# EAGLE design Samid6322 (EAGLE 9.6.2)
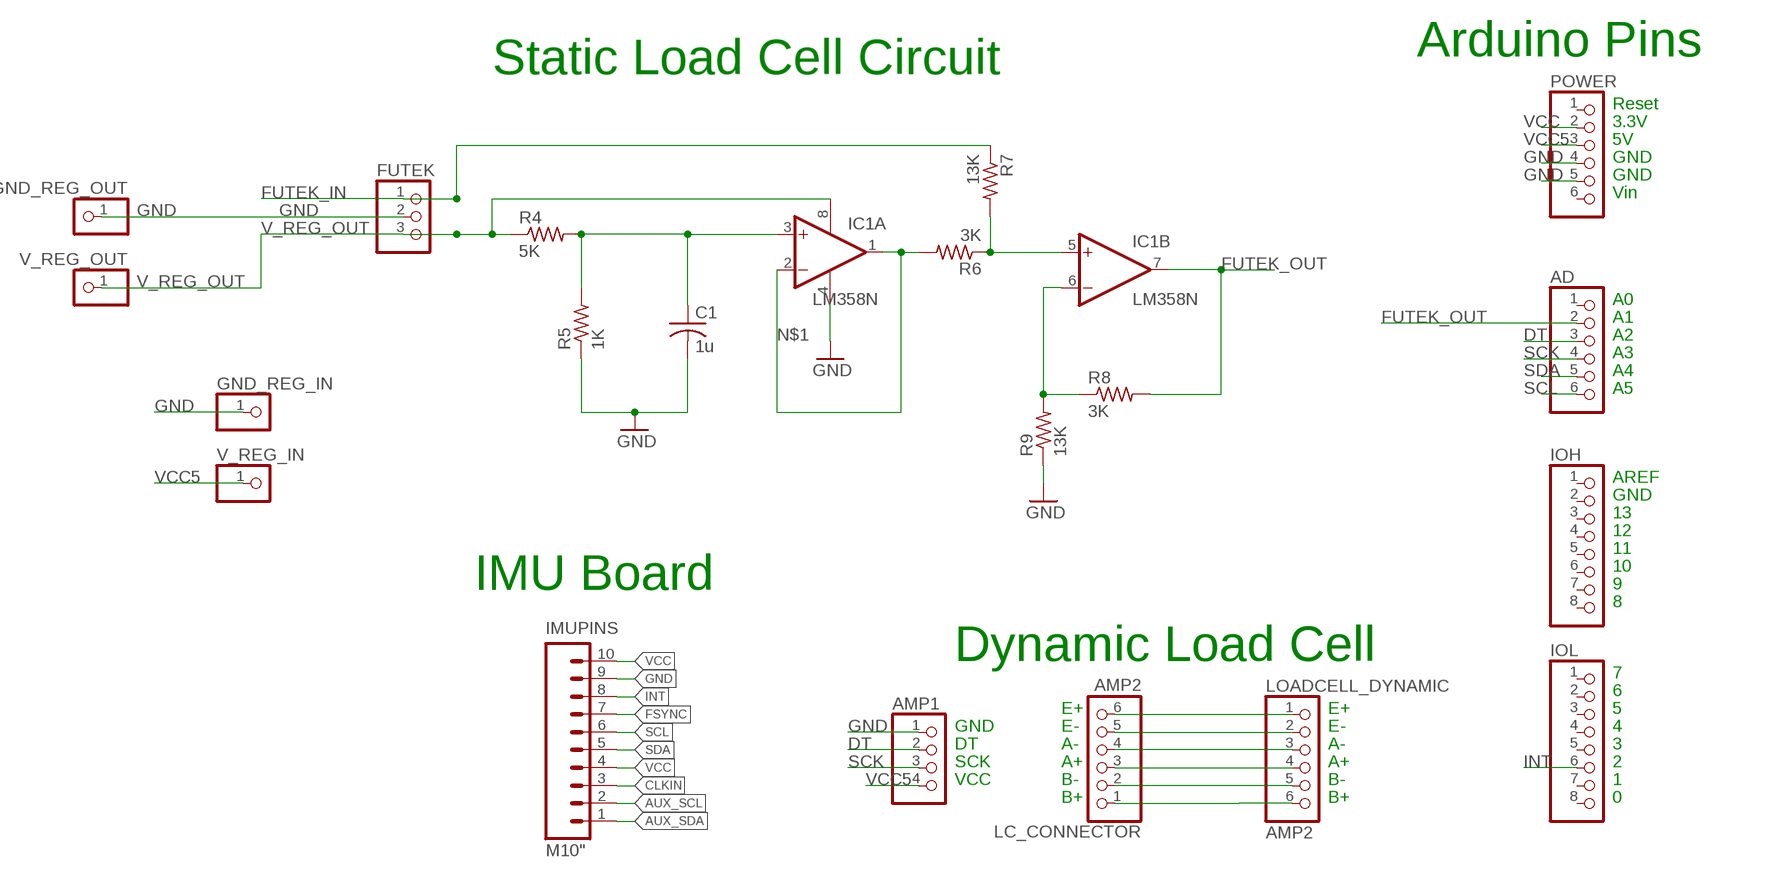
[diagram p0: schematic, sheet 1]

## Parts
AD  PINHD-1X6  [1X06]
AMP1  PINHD-1X4  [1X04]
C1  1u  C-US025-024X044  [C025-024X044]
FUTEK  PINHD-1X3  [1X03]
GND_REG_IN  PINHD-1X1  [1X01]
GND_REG_OUT  PINHD-1X1  [1X01]
IC1  LM358N  [DIL08]
IMUPINS  M10"  [1X10]
IOH  PINHD-1X8  [1X08]
IOL  PINHD-1X8  [1X08]
LC_CONNECTOR  AMP2  PINHD-1X6  [1X06]
LOADCELL_DYNAMIC  AMP2  PINHD-1X6  [1X06]
POWER  PINHD-1X6  [1X06]
R4  5K  R-US_0204/7  [0204/7]
R5  1K  R-US_0204/7  [0204/7]
R6  3K  R-US_0204/7  [0204/7]
R7  13K  R-US_0204/7  [0204/7]
R8  3K  R-US_0204/7  [0204/7]
R9  13K  R-US_0204/7  [0204/7]
V_REG_IN  PINHD-1X1  [1X01]
V_REG_OUT  PINHD-1X1  [1X01]

## Nets
AUX_SCL: IMUPINS.2
AUX_SDA: IMUPINS.1
CLKIN: IMUPINS.3
DT: AD.3 AMP1.2
FSYNC: IMUPINS.7
FUTEK_IN: FUTEK.1 R7.1
FUTEK_OUT: AD.2 IC1.7(B:OUT) R8.2
GND: AMP1.1 C1.2 FUTEK.2 GND_REG_IN.1 GND_REG_OUT.1 IC1.4(P:V-) IMUPINS.9 POWER.4 POWER.5 R5.1 R9.1
INT: IMUPINS.8 IOL.6
N$1: IC1.1(A:OUT) IC1.2(A:-IN) R6.2
N$2: LC_CONNECTOR.6 LOADCELL_DYNAMIC.1
N$4: LC_CONNECTOR.5 LOADCELL_DYNAMIC.2
N$5: LC_CONNECTOR.4 LOADCELL_DYNAMIC.3
N$6: LC_CONNECTOR.3 LOADCELL_DYNAMIC.4
N$7: LC_CONNECTOR.2 LOADCELL_DYNAMIC.5
N$8: LC_CONNECTOR.1 LOADCELL_DYNAMIC.6
N$11: IC1.5(B:+IN) R6.1 R7.2
N$12: C1.1 IC1.3(A:+IN) R4.2 R5.2
N$14: IC1.6(B:-IN) R8.1 R9.2
SCK: AD.4 AMP1.3
SCL: AD.6 IMUPINS.6
SDA: AD.5 IMUPINS.5
V_REG_OUT: FUTEK.3 IC1.8(P:V+) R4.1 V_REG_OUT.1
VCC: IMUPINS.4 IMUPINS.10 POWER.2
VCC5: AMP1.4 POWER.3 V_REG_IN.1
Unconnected: AD.1 IOH.1 IOH.2 IOH.3 IOH.4 IOH.5 IOH.6 IOH.7 IOH.8 IOL.1 IOL.2 IOL.3 IOL.4 IOL.5 IOL.7 IOL.8 POWER.1 POWER.6

## Notes on the sheet
- Arduino Pins
- Static Load Cell Circuit
- Reset
- 3.3V
- 5V
- GND
- GND
- Vin
- A0
- A1
- A2
- A3
- A4
- A5
- AREF
- GND
- 13
- 12
- 11
- 10
- IMU Board | 9
- 8
- Dynamic Load Cell
- 7
- 6
- E+ | E+ | 5
- GND | E- | E- | 4
- DT | A- | A- | 3
- SCK | A+ | A+ | 2
- VCC | B- | B- | 1
- B+ | B+ | 0

## Library data of the parts
AD LC_CONNECTOR LOADCELL_DYNAMIC POWER = pinhead:PINHD-1X6: PIN HEADER
AMP1 = pinhead:PINHD-1X4: PIN HEADER
C1 = rcl:C-US: CAPACITOR, American symbol; SPICEPREFIX: C
FUTEK = pinhead:PINHD-1X3: PIN HEADER
GND_REG_IN GND_REG_OUT V_REG_IN V_REG_OUT = pinhead:PINHD-1X1: PIN HEADER
IC1 = linear:LM358: OP AMP also LM158; LM258; LM2904 Source: http://cache.national.com/ds/LM/LM158.pdf
IMUPINS = SparkFun:M10: Header 10 Standard 10-pin 0.1" header. Use with straight break away headers (SKU : PRT-00116), right angle break away headers (PRT-00553), swiss pins (PRT-00743), machine pins (PRT-00117), and female headers (PRT-00115).
IOH IOL = pinhead:PINHD-1X8: PIN HEADER
R4-R9 = rcl:R-US_: RESISTOR, American symbol; SPICEPREFIX: R

## Net classes
0 Default: width 0.203 mm
1 vcc: width 0.254 mm
2 GND: width 0.813 mm

## Board
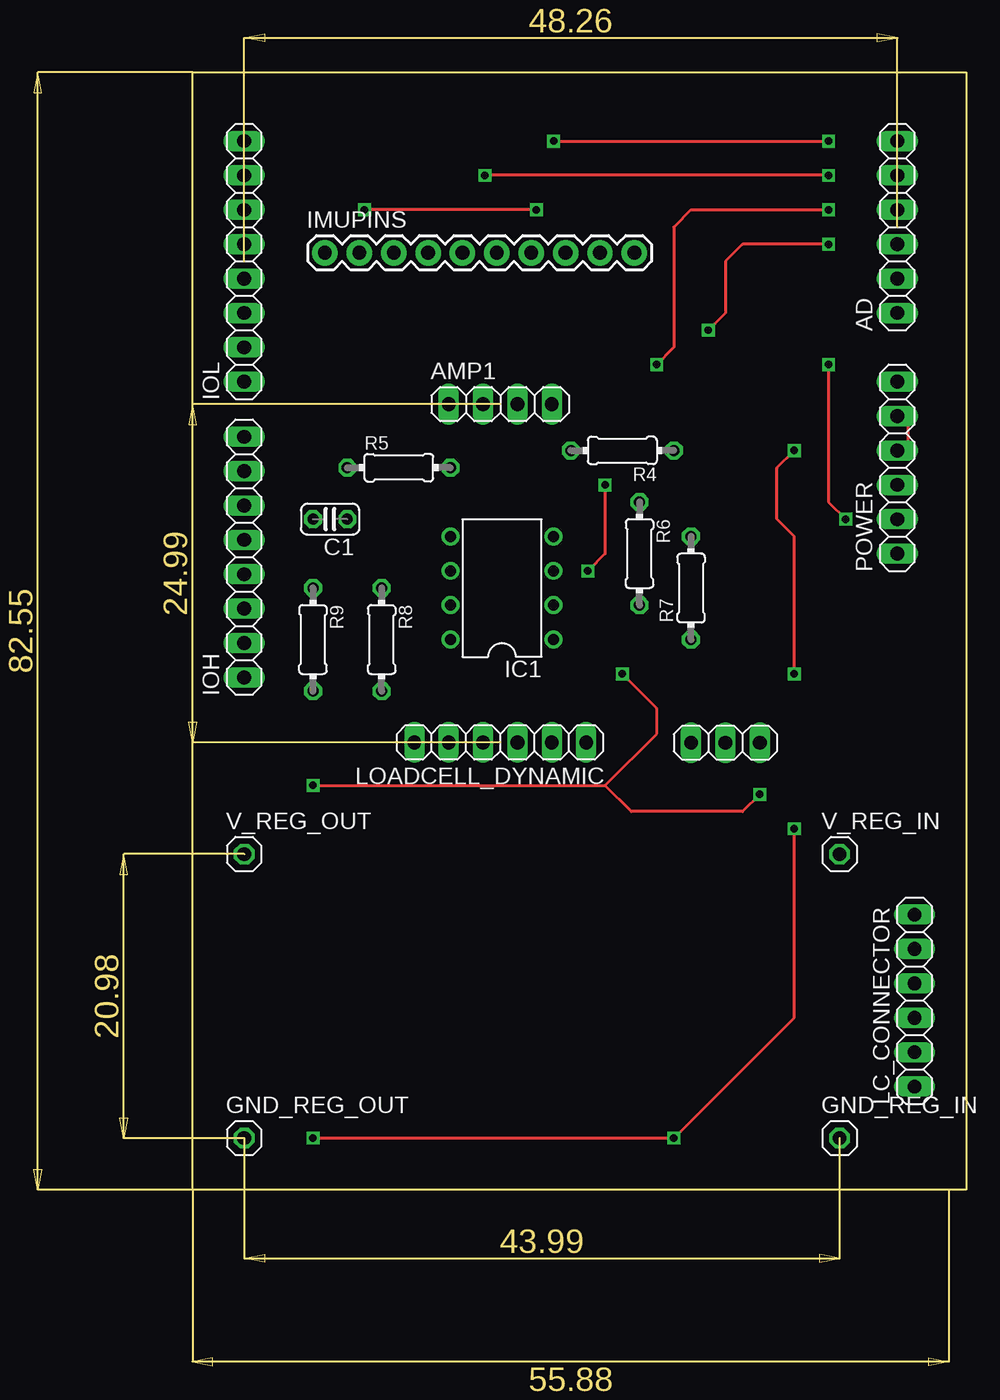
[diagram p1: board, top side]
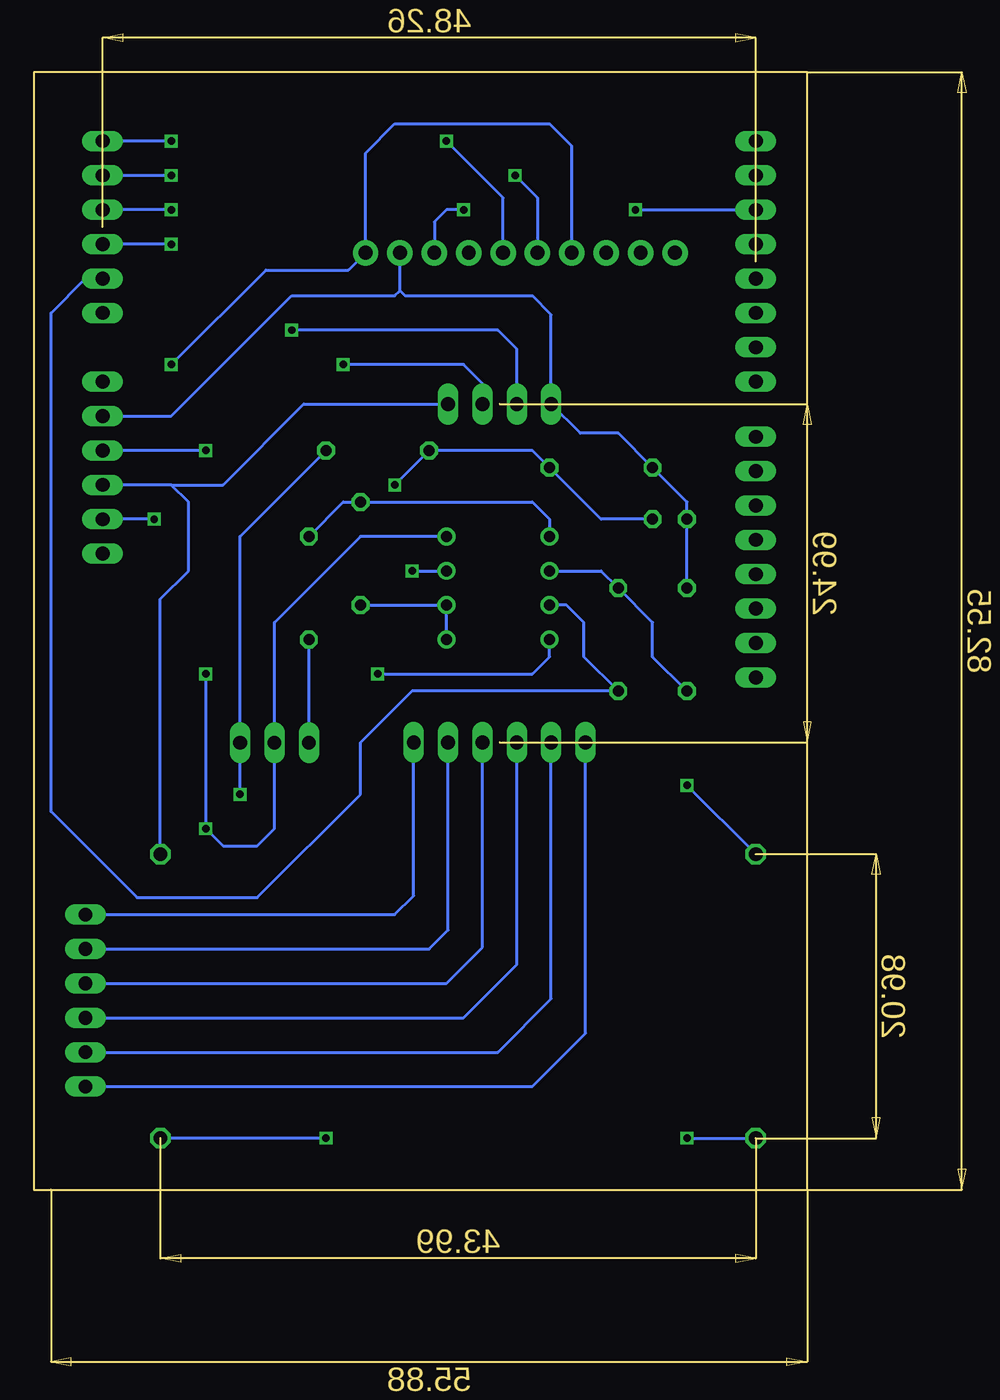
[diagram p2: board, bottom side, seen from below]

Size 57.15 x 82.55 mm. Coordinates in mm from the lower left corner, seen from the top.
Outline: 0,82.55 57.15,82.55 57.15,0 0,0 0,82.55
Copper layers (1*16): Top 0.035mm / dielectric 1.5mm / Bottom 0.035mm
Design rules "default": minimum track width 6mil, minimum drill 0.35mm, track to track 6mil, track to pad 6mil, pad to pad 6mil, via to via 6mil, smd to smd 6mil, copper to edge 40mil, drill to drill 6mil, minimum pad ring 10mil, minimum via ring 8mil, stop-mask expansion 4mil, vias tented up to drill 0mil, thermal gap 10mil

### Footprints (pad centres in the part's own frame; a part is rotated, then mirrored left to right if it is on the bottom)
1X06 = drill 1.016 long: 1 -6.35,0; 2 -3.81,0; 3 -1.27,0; 4 1.27,0; 5 3.81,0; 6 6.35,0
1X04 = drill 1.016 long: 1 -3.81,0; 2 -1.27,0; 3 1.27,0; 4 3.81,0
C025-024X044 = drill 0.813 octagon: 1 -1.27,0; 2 1.27,0
1X03 = drill 1.016 long: 1 -2.54,0; 2 0,0; 3 2.54,0
1X01 = drill 1.016 octagon: 1 0,0
DIL08 = drill 0.813 pad 1.27: 1 -3.81,-3.81; 2 -1.27,-3.81; 3 1.27,-3.81; 4 3.81,-3.81; 5 3.81,3.81; 6 1.27,3.81; 7 -1.27,3.81; 8 -3.81,3.81
1X10 = drill 1.016 pad 1.88: 1 0,0; 2 2.54,0; 3 5.08,0; 4 7.62,0; 5 10.16,0; 6 12.7,0; 7 15.24,0; 8 17.78,0; 9 20.32,0; 10 22.86,0
1X08 = drill 1.016 long: 1 -8.89,0; 2 -6.35,0; 3 -3.81,0; 4 -1.27,0; 5 1.27,0; 6 3.81,0; 7 6.35,0; 8 8.89,0
0204/7 = drill 0.813 octagon: 1 -3.81,0; 2 3.81,0

### Placement (x,y rotation side)
AD  52.07,71.12 90 top
AMP1  22.73,58.04 0 top
C1  10.16,49.53 180 top
FUTEK  39.37,33.02 0 top
GND_REG_IN  47.8,3.81 0 top
GND_REG_OUT  3.81,3.81 0 top
IC1  22.86,44.45 90 top
IMUPINS  9.78,69.22 0 top
IOH  3.81,46.74 90 top
IOL  3.81,68.58 90 top
LC_CONNECTOR  53.34,13.97 90 top
LOADCELL_DYNAMIC  22.73,33.05 180 top
POWER  52.07,53.34 90 top
R4  31.75,54.61 180 top
R5  15.24,53.34 0 top
R6  33.02,46.99 270 top
R7  36.83,44.45 90 top
R8  13.97,40.64 270 top
R9  8.89,40.64 270 top
V_REG_IN  47.8,24.79 0 top
V_REG_OUT  3.81,24.79 0 top

### Tracks (layer width: path | path; a pad name or v marks a point on that pad's centre or on a via)
DT  (via drill 0.55 pad 0.65)
  Top 0.203: v46.99,69.85 40.64,69.85 39.37,68.58 39.37,64.77 v38.1,63.5
  Bottom 0.203: v46.99,69.85 AD.3 | AMP1.2 21.46,62.1 22.86,63.5 v38.1,63.5
FUTEK_IN
  Bottom 0.203: FUTEK.1 R7.1
FUTEK_OUT
  Bottom 0.203: AD.2 53.34,67.31 55.88,64.77 55.88,27.94 49.53,21.59 40.64,21.59 33.02,29.21 33.02,33.02 29.21,36.83 R8.2 16.51,39.37 16.51,41.91 17.78,43.18 IC1.7
GND  (via drill 0.55, 0.55 pad 0.65)
  Top 0.203: v44.45,26.67 44.45,12.7 v35.56,3.81 v8.89,3.81 | POWER.5 52.83,57.15 52.83,54.61 POWER.4 | v44.45,38.1 44.45,48.26 43.18,49.53 43.18,53.34 v44.45,54.61
  Bottom 0.203: POWER.5 46.99,57.15 38.1,66.04 30.48,66.04 30.1,66.42 | 30.1,66.42 IMUPINS.9 | 30.1,66.42 29.72,66.04 20.32,66.04 18.92,64.64 AMP1.1 16.76,55.88 13.97,55.88 R5.1 8.89,50.8 C1.2 R9.1 | v8.89,3.81 GND_REG_OUT.1 | v35.56,3.81 GND_REG_IN.1 | v44.45,38.1 v44.45,26.67 43.18,25.4 40.64,25.4 39.37,26.67 FUTEK.2 39.37,41.91 33.02,48.26 IC1.4 | v44.45,54.61 POWER.4
INT  (via drill 0.55 pad 0.65)
  Top 0.203: v25.4,72.39 v12.7,72.39
  Bottom 0.203: v12.7,72.39 IOL.6 | IMUPINS.8 27.56,71.5 26.67,72.39 v25.4,72.39
N$1
  Bottom 0.203: R6.2 IC1.2 IC1.1
N$2
  Bottom 0.203: LC_CONNECTOR.6 30.48,20.32 29.08,21.72 LOADCELL_DYNAMIC.1
N$4
  Bottom 0.203: LC_CONNECTOR.5 27.94,17.78 26.54,19.18 LOADCELL_DYNAMIC.2
N$5
  Bottom 0.203: LC_CONNECTOR.4 26.67,15.24 24,17.91 LOADCELL_DYNAMIC.3
N$6
  Bottom 0.203: LC_CONNECTOR.3 25.4,12.7 21.46,16.64 LOADCELL_DYNAMIC.4
N$7
  Bottom 0.203: LC_CONNECTOR.2 22.86,10.16 18.92,14.1 LOADCELL_DYNAMIC.5
N$8
  Bottom 0.203: LC_CONNECTOR.1 20.32,7.62 16.38,11.56 LOADCELL_DYNAMIC.6
N$11
  Bottom 0.203: R7.2 34.29,50.8 R6.1 20.32,50.8 19.05,49.53 IC1.5
N$12  (via drill 0.55)
  Top 0.203: v30.48,52.07 30.48,46.99 v29.2,45.71
  Bottom 0.203: v29.2,45.71 26.68,45.71 IC1.3 | v30.48,52.07 R4.2 20.32,54.61 R5.2 15.24,49.53 C1.1
N$14
  Bottom 0.203: R9.2 11.43,39.37 11.43,41.91 R8.1 15.24,45.72 IC1.6
SCK  (via drill 0.55 pad 0.65)
  Top 0.203: v34.29,60.96 35.56,62.23 35.56,71.12 36.83,72.39 v46.99,72.39
  Bottom 0.203: v46.99,72.39 AD.4 | v34.29,60.96 25.4,60.96 25.27,60.83 24,59.56 AMP1.3
SCL  (via drill 0.55 pad 0.65)
  Top 0.203: v26.67,77.47 v46.99,77.47
  Bottom 0.203: IMUPINS.6 22.48,73.28 v26.67,77.47 | v46.99,77.47 AD.6
SDA  (via drill 0.55 pad 0.65)
  Top 0.203: v46.99,74.93 v21.59,74.93
  Bottom 0.203: AD.5 v46.99,74.93 | IMUPINS.5 19.94,73.28 v21.59,74.93
V_REG_OUT  (via drill 0.55, 0.55 pad 0.65)
  Top 0.203: v8.89,29.87 30.48,29.87 | v41.91,29.21 40.64,27.94 32.41,27.94 30.48,29.87 | 30.48,29.87 34.29,33.68 34.29,35.56 v31.75,38.1
  Bottom 0.203: V_REG_OUT.1 v8.89,29.87 | R4.1 41.91,48.26 FUTEK.3 v41.91,29.21 | IC1.8 19.05,39.37 20.32,38.1 v31.75,38.1
VCC  (via drill 0.55 pad 0.65)
  Top 0.203: v46.99,60.96 46.99,50.8 v48.26,49.53
  Bottom 0.203: IMUPINS.4 17.4,77.09 19.05,78.74 30.48,78.74 32.64,76.58 IMUPINS.10 33.91,67.94 40.01,67.94 v46.99,60.96 | v48.26,49.53 POWER.2
VCC5
  Bottom 0.203: V_REG_IN.1 47.8,43.64 45.72,45.72 45.72,50.8 46.99,52.07 | 46.99,52.07 43.18,52.07 37.21,58.04 AMP1.4 | 46.99,52.07 POWER.3